# Altium schematic sheet UART_JTAG.SchDoc: UART & JTAG
size A4; DrawnBy: Patrik Staudenmayer; DocumentNumber: 7; SheetNumber: 7; SheetTotal: 15
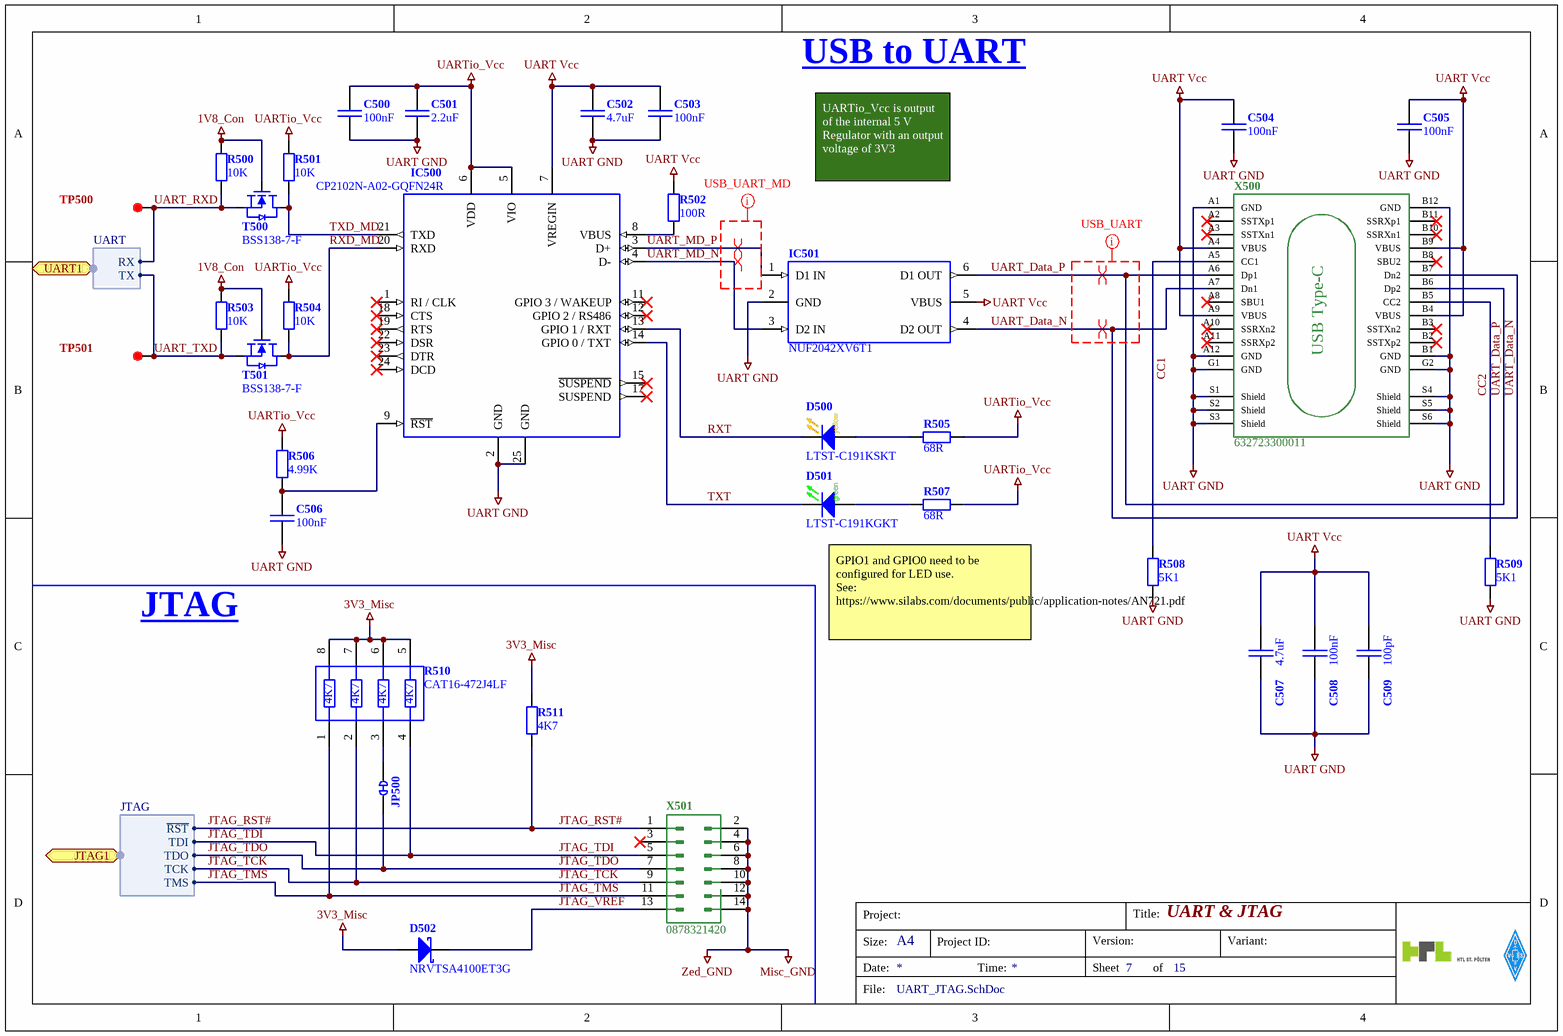
[diagram p0: UART_JTAG.SchDoc]

## Parts
C500  100nF  [C_0603_N [CAPC1608N IPC]]
C501  2.2uF  [C_0805_N [CAPC2013N IPC]]
C502  4.7uF  [C_0805_N [CAPC2013N IPC]]
C503  100nF  [C_0603_N [CAPC1608N IPC]]
C504  100nF  [C_0603_N [CAPC1608N IPC]]
C505  100nF  [C_0603_N [CAPC1608N IPC]]
C506  100nF  [C_0603_N [CAPC1608N IPC]]
C507  4.7uF  [C_1210_N [CAPC3225N IPC]]
C508  100nF  [C_0805_N [CAPC2013N IPC]]
C509  100pF  [C_0603_N [CAPC1608N IPC]]
D500  LTST-C191KSKT  [LED_0603-YELLOW_N_AK]
D501  LTST-C191KGKT  [LED_0603-GREEN_N_AK]
D502  NRVTSA4100ET3G  [DIOM4326X22N IPC]
IC500  CP2102N-A02-GQFN24R  [QFN50P400X400X80_HS-25N IPC]
IC501  NUF2042XV6T1  [SOTFL50P160X60-6N IPC]
JP500  JP_Connected  [JP_Connected]  (value not drawn)  (no BOM)
R500  10K  [R_0201_L [RESC0603L IPC]]
R501  10K  [R_0201_L [RESC0603L IPC]]
R502  100R  [R_0603_N [RESC1608N IPC]]
R503  10K  [R_0201_L [RESC0603L IPC]]
R504  10K  [R_0201_L [RESC0603L IPC]]
R505  68R  [R_0603_N [RESC1608N IPC]]
R506  4.99K  [R_0201_L [RESC0603L IPC]]
R507  68R  [R_0603_N [RESC1608N IPC]]
R508  5K1  [R_0603_N [RESC1608N IPC]]
R509  5K1  [R_0603_N [RESC1608N IPC]]
R510  CAT16-472J4LF  [CAC-80P320X155-8N]
R511  4K7  [R_0603_N [RESC1608N IPC]]
T500  BSS138-7-F  [SOT105P235X102-3N IPC]
T501  BSS138-7-F  [SOT105P235X102-3N IPC]
TP500  TP_GENERIC  [TP_0.8_P100T]  (value not drawn)  (no BOM)
TP501  TP_GENERIC  [TP_0.8_P100T]  (value not drawn)  (no BOM)
X500  632723300011  [X_632723300011]
X501  0878321420  [X_SMD_HEADER2x7_P254_H0_Prometheus]

## Ports
JTAG1 (bidir, harness JTAG), UART1 (bidir, harness UART)

## Harnesses
UART: RX, TX
JTAG: TMS, TCK, TDI, TDO, ~{RST}

## Nets
1V8_Con: R500.2 R503.2 T500.G T501.G
3V3_Misc: D502.A R510.5 R510.6 R510.7 R510.8 R511.2
Misc_GND: X501.2 X501.4 X501.6 X501.8 X501.10 X501.12 X501.14  [also labelled Zed_GND]
UART GND: C500.2 C501.2 C502.2 C503.2 C504.2 C505.2 C506.2 C507.2 C508.2 C509.2 IC500.2(GND) IC500.25(GND) IC501.2(GND) R508.1 R509.1 X500.A1(GND) X500.A12(GND) X500.B1(GND) X500.B12(GND) X500.G1(GND) X500.G2(GND) X500.S1(Shield) X500.S2(Shield) X500.S3(Shield) X500.S4(Shield) X500.S5(Shield) X500.S6(Shield)
UART Vcc: C502.1 C503.1 C504.1 C505.1 C507.1 C508.1 C509.1 IC500.7(VREGIN) IC501.5(VBUS) R502.1 X500.A4(VBUS) X500.A9(VBUS) X500.B4(VBUS) X500.B9(VBUS)
UARTio_Vcc: C500.1 C501.1 IC500.5(VIO) IC500.6(VDD) R501.2 R504.2 R505.1 R506.2 R507.1
CC1: R508.2 X500.A5(CC1)
CC2: R509.2 X500.B5(CC2)
JTAG_RST#: R511.1 X501.1 ; port JTAG1.~{RST}
JTAG_TCK: R510.2 X501.9 ; port JTAG1.TCK
JTAG_TDI: R510.4 X501.5 ; port JTAG1.TDI
JTAG_TDO: JP500.2(-) X501.7 ; port JTAG1.TDO
JTAG_TMS: R510.1 X501.11 ; port JTAG1.TMS
JTAG_VREF: D502.K X501.13
RXD_MD: IC500.20(RXD) R504.1 T501.D
RXT: D500.K IC500.13(GPIO_1_/_RXT)
TXD_MD: IC500.21(TXD) R501.1 T500.D
TXT: D501.K IC500.14(GPIO_0_/_TXT)
UART_Data_N: IC501.4(D2_OUT) X500.A7(Dn1) X500.B7(Dn2)
UART_Data_P: IC501.6(D1_OUT) X500.A6(Dp1) X500.B6(Dp2)
UART_MD_N: IC500.4(D-) IC501.3(D2_IN)
UART_MD_P: IC500.3(D+) IC501.1(D1_IN)
UART_RXD: R500.1 T500.S TP500.1 ; port UART1.RX
UART_TXD: R503.1 T501.S TP501.1 ; port UART1.TX
NetC506_1: C506.1 IC500.9(~{RST}) R506.1
NetD500_A: D500.A R505.2
NetD501_A: D501.A R507.2
NetIC500_8: IC500.8(VBUS) R502.2
NetJP500_1: JP500.1(+) R510.3

Not connected (* = marked no-connect by the designer): IC500 1(RI_/_CLK)* 11(GPIO_3_/_WAKEUP)* 12(GPIO_2_/_RS486)* 15(~{SUSPEND})* 17(SUSPEND)* 18(CTS)* 19(RTS)* 22(DSR)* 23(DTR)* 24(DCD)*; X500 A2(SSTXp1)* A3(SSTXn1)* A8(SBU1)* A10(SSRXn2)* A11(SSRXp2)* B2(SSTXp2)* B3(SSTXn2)* B8(SBU2)* B10(SSRXn1)* B11(SSRXp1)*; X501 3*

## Layout directives
rule Differential Pairs Routing [Pref Gap = 5mil    Min Gap  = 5mil    Max Gap  = 5milPref Width = 5.458mil    Min Width  = 3.981mil    Max Width  = 5.458mil]; rule Maximum Via Count Constraint [Max Count = 2]; rule Matched Net Lengths [Tolerance = 25mil]: (no net found under the mark)
differential pair: UART_Data_N, UART_Data_P, UART_MD_N, UART_MD_P

## Notes on the sheet
- USB to UART
- UARTio_Vcc is output of the internal 5 V Regulator with an output voltage of 3V3
- JTAG
- GPIO1 and GPIO0 need to be configured for LED use.
  See: https://www.silabs.com/documents/public/application-notes/AN721.pdf
- Project:
- Title:
- Size:
- Date:
- A4
- Project ID:
- Time:
- Sheet
- Version:
- of
- Variant:
- File:
- (in symbol LED_GREEN_GENERIC) green
- (in symbol LED_YELLOW_GENERIC) yellow
- (in symbol R_CAT16-472J4LF) 4K7
- (in symbol X_632723300011) USB Type-C

## Library data of the parts
C500-C509 = C_GENERIC: Prometheus_ID: *; Prometheus_Manufacturer: *
  C500 C503-C506: Prometheus_ManPartNo: 100nF; Prometheus_Comment: 100nF; Prometheus_CurrentFootprint: C_0603_N [CAPC1608N IPC]
  C501: Prometheus_ManPartNo: 2.2uF; Prometheus_Comment: 2.2uF; Prometheus_CurrentFootprint: C_0805_N [CAPC2013N IPC]
  C502: Prometheus_ManPartNo: 4.7uF; Prometheus_Comment: 4.7uF; Prometheus_CurrentFootprint: C_0805_N [CAPC2013N IPC]
  C507: Prometheus_ManPartNo: 4.7uF; Prometheus_Comment: 4.7uF; Prometheus_CurrentFootprint: C_1210_N [CAPC3225N IPC]
  C508: Prometheus_ManPartNo: 100nF; Prometheus_Comment: 100nF; Prometheus_CurrentFootprint: C_0805_N [CAPC2013N IPC]
  C509: Prometheus_ManPartNo: 100pF; Prometheus_Comment: 100pF; Prometheus_CurrentFootprint: C_0603_N [CAPC1608N IPC]
D500 = LED_YELLOW_GENERIC: Prometheus_ID: *; Prometheus_ManPartNo: LTST-C191KSKT; Prometheus_Manufacturer: *; Prometheus_Comment: LTST-C191KSKT; Prometheus_CurrentFootprint: LED_0603-YELLOW_N_AK; ComponentLink1Description: Datasheet; ComponentLink1URL: https://optoelectronics.liteon.com/upload/download/DS22-2000-224/LTST-C191KSKT.PDF
D501 = LED_GREEN_GENERIC: Prometheus_Manufacturer: Lite-On Inc.; Prometheus_ID: *; Prometheus_ManPartNo: LTST-C191KGKT; Prometheus_Comment: LTST-C191KGKT; Prometheus_CurrentFootprint: LED_0603-GREEN_N_AK; ComponentLink1Description: Datasheet; ComponentLink1URL: https://optoelectronics.liteon.com/upload/download/DS22-2000-228/LTST-C191KGKT.PDF
D502 = D_SCHOTTKY_NRVTSA4100E: max. Vr = 100 V / max Vf = 680 mV; Prometheus_Manufacturer: ON Semiconductor; Prometheus_ID: *; Prometheus_ManPartNo: NRVTSA4100ET3G; Prometheus_Comment: NRVTSA4100ET3G; Prometheus_CurrentFootprint: DIOM4326X22N IPC
IC500 = IC_CP2102N: USB to UART Data Transfer / USB 2.0 compliant; full speed (12Mbps) / Single power supply of 3.0 to 3.6 V or 3.0 to 5.25 V / Virtual COM Port Device Drivers; Prometheus_Manufacturer: Silabs; Prometheus_ManPartNo: CP2102N-A02-GQFN24R; Prometheus_Comment: CP2102N-A02-GQFN24R; Prometheus_CurrentFootprint: QFN50P400X400X80_HS-25N IPC
IC501 = IC_NUF2042XV6T1: USB Upstream Terminator with ESD Protection / Compliance with IEC61000-4-2 (Level 4) / 8 kV (Contact) / 15 kV (Air) / ESD Ratings: / Machine Model = C / Human Body Model = 3B; Prometheus_Manufacturer: ON Semiconductor; Prometheus_ManPartNo: NUF2042XV6T1; Prometheus_Comment: NUF2042XV6T1; Prometheus_CurrentFootprint: SOTFL50P160X60-6N IPC
R500-R509 R511 = R_GENERIC_DIN: Prometheus_ID: *; Prometheus_Manufacturer: *
  R500 R501 R503 R504: Prometheus_ManPartNo: 10K; Prometheus_Comment: 10K; Prometheus_CurrentFootprint: R_0201_L [RESC0603L IPC]
  R502: Prometheus_ManPartNo: 100R; Prometheus_Comment: 100R; Prometheus_CurrentFootprint: R_0603_N [RESC1608N IPC]
  R505 R507: Prometheus_ManPartNo: 68R; Prometheus_Comment: 68R; Prometheus_CurrentFootprint: R_0603_N [RESC1608N IPC]
  R506: Prometheus_ManPartNo: 4.99K; Prometheus_Comment: 4.99K; Prometheus_CurrentFootprint: R_0201_L [RESC0603L IPC]
  R508 R509: Prometheus_ManPartNo: 5K1; Prometheus_Comment: 5K1; Prometheus_CurrentFootprint: R_0603_N [RESC1608N IPC]
  R511: Prometheus_ManPartNo: 4K7; Prometheus_Comment: 4K7; Prometheus_CurrentFootprint: R_0603_N [RESC1608N IPC]
R510 = R_CAT16-472J4LF: Resitor array 4 x 4K7 1206; Prometheus_Manufacturer: Bourns Inc.; Prometheus_ID: *; Prometheus_ManPartNo: CAT16-472J4LF; Prometheus_Comment: CAT16-472J4LF; Prometheus_CurrentFootprint: CAC-80P320X155-8N
T500 T501 = T_NMOS_BSS138-7-F: VDS = 50 V / VDG = 50 V / VGS = +-20 V / ID = 200 mA / VGS_th = typ. 1.2 V / RDS_on = typ. 1.4 OHM; Prometheus_Manufacturer: Diodes Incorporated; Prometheus_ID: *; Prometheus_ManPartNo: BSS138-7-F; Prometheus_Comment: BSS138-7-F; Prometheus_CurrentFootprint: SOT105P235X102-3N IPC; ComponentLink1Description: Datasheet; ComponentLink1URL: https://www.diodes.com/assets/Datasheets/ds30144.pdf
TP500 TP501 = TP_GENERIC: Needle Test Point; Prometheus_ID: *; Prometheus_ManPartNo: TP_GENERIC; Prometheus_Manufacturer: *; Prometheus_Comment: TP_GENERIC; Prometheus_CurrentFootprint: TP_0.8_P100T
X500 = X_632723300011: USB Type-C Receptabel / Horizontal / 1.6 mm PCB thickness; Prometheus_Manufacturer: Wuerth Electronics; Prometheus_ID: *; Prometheus_ManPartNo: 632723300011; Prometheus_Comment: 632723300011; Prometheus_CurrentFootprint: X_632723300011
X501 = X_HEADER_SMD_7x2_RM2.54: Pin-Header RM2.54, straight, 7pin, dual row; Prometheus_Manufacturer: Molex; Prometheus_ID: *; Prometheus_ManPartNo: 0878321420; Prometheus_Comment: 0878321420; Prometheus_CurrentFootprint: X_SMD_HEADER2x7_P254_H0_Prometheus
JP500 = JP_Connected: Prometheus_ID: *; Prometheus_ManPartNo: JP_Connected; Prometheus_Manufacturer: *; Prometheus_Comment: JP_Connected; Prometheus_CurrentFootprint: JP_Connected